# Altium project BI_820_Trek_GSM_GPS_hv3.PrjPCB
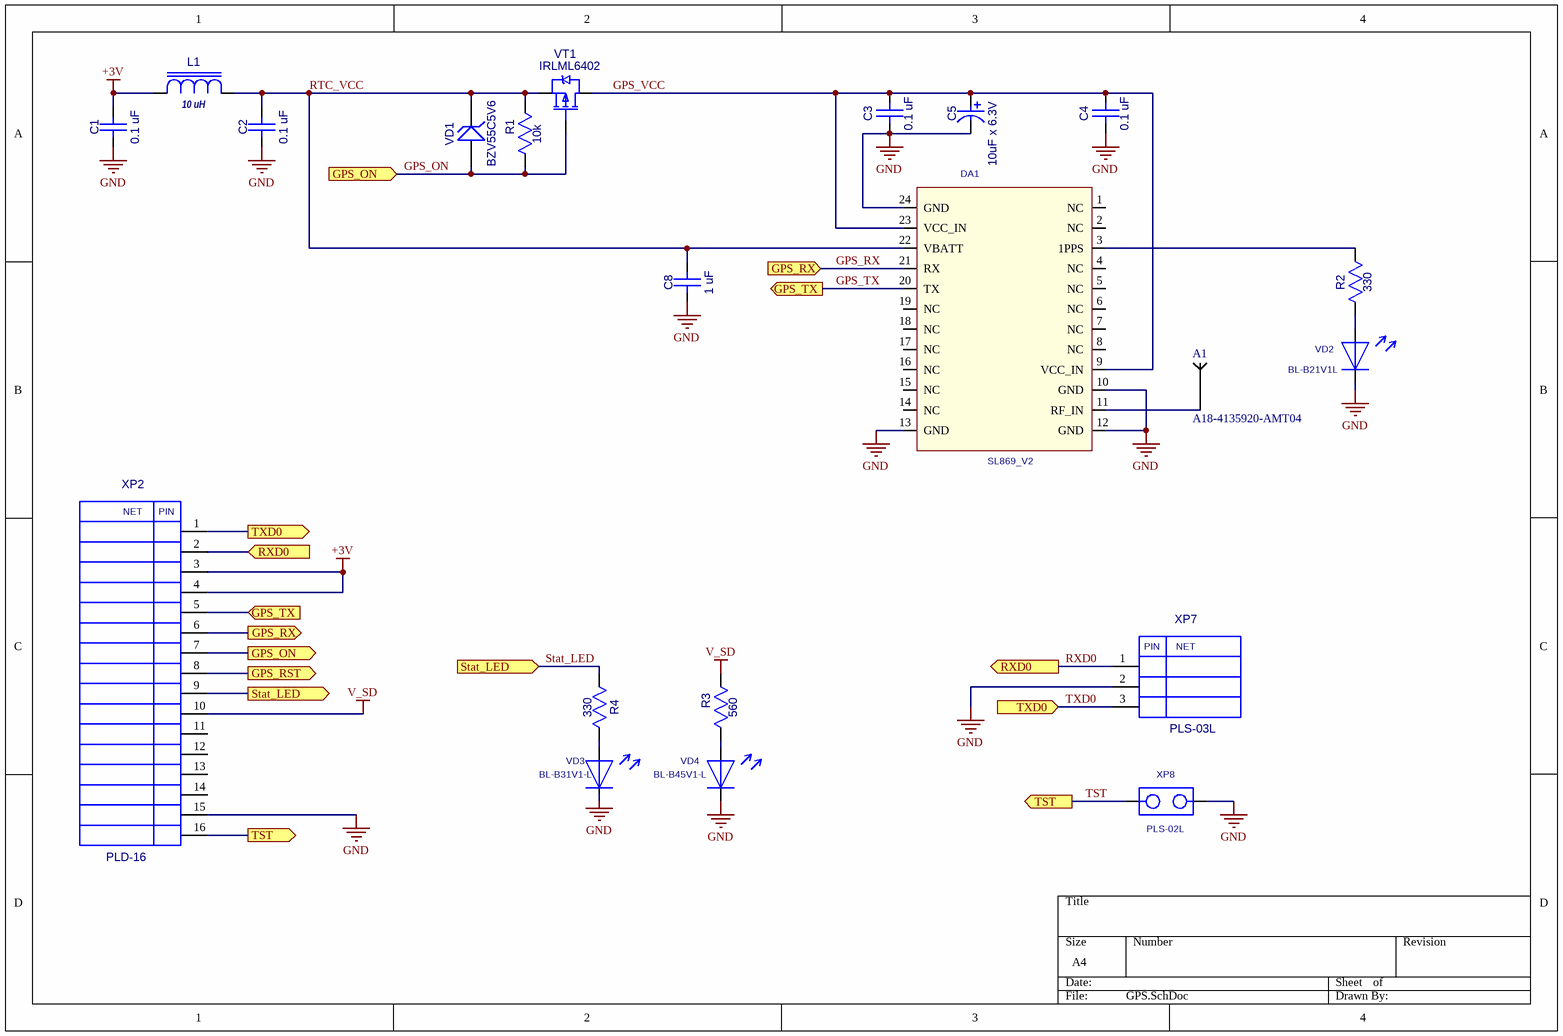
[diagram p0: GPS.SchDoc]
2 sheets, 43 parts. Net scope: flat (ports and power ports of the same name join across sheets).
Board file: BI_820_Trek_GSM_GPS_hv3.PcbDoc
Sheets:
  GPS.SchDoc
  GSM.SchDoc

## Sheet GPS.SchDoc
size A4

### Parts
A1  A18-4135920-AMT04  [BY-GPS-204]
C1  0.1 uF  [CC0603-3M]
C2  0.1 uF  [CC0603-3M]
C3  0.1 uF  [CC0603-3M]
C4  0.1 uF  [CC0603-3M]
C5  10uF x 6.3V  [TAJ-A_M]
C8  1 uF  [CC0603-3M]
DA1  SL869_V2  [SL868]
L1  10 uH  [RC0805-MIDI-2]
R1  10k  [RC0603-3M]
R2  330  [RC0603-3M]
R3  560  [RC0603-3M]
R4  330  [RC0603-3M]
VD1  BZV55C5V6  [SOD80]
VD2  BL-B21V1L  [LED3]
VD3  BL-B31V1-L  [LED3]
VD4  BL-B45V1-L  [LED3]
VT1  IRLML6402  [SOT-23(123)]
XP2  PLD-16  [PIN16]
XP7  PLS-03L  [PLS-03L]
XP8  PLS-02L  [PLS-02L]

### Ports
GPS_ON (in), GPS_ON (out), GPS_RST (out), GPS_RX (in), GPS_RX (out), GPS_TX (in), GPS_TX (out), RXD0 (in), RXD0 (out), Stat_LED (in), Stat_LED (out), TST (out), TXD0 (in), TXD0 (out)

### Nets
+3V: C1.2(B) L1.1(A) XP2.3 XP2.4
GND: C1.1(A) C2.1(A) C3.2(B) C4.2(B) C5.2(B) C8.1(A) DA1.10(GND) DA1.12(GND) DA1.13(GND) DA1.24(GND) VD2.1 VD3.1 VD4.1 XP2.15 XP7.2 XP8.2
V_SD: R3.2(B) XP2.10
GPS_ON: R1.2(B) VD1.1(A) VT1.1(G) XP2.7 ; port GPS_ON
GPS_RX: DA1.21(RX) XP2.6 ; port GPS_RX
GPS_TX: DA1.20(TX) XP2.5 ; port GPS_TX
GPS_VCC: C3.1(A) C4.1(A) C5.1(A) DA1.9(VCC_IN) DA1.23(VCC_IN) VT1.3(D)
RTC_VCC: C2.2(B) C8.2(B) DA1.22(VBATT) L1.2(B) R1.1(A) VD1.2 VT1.2(S)
RXD0: XP2.2 XP7.1 ; port RXD0
Stat_LED: R4.2(B) XP2.9 ; port Stat_LED
TST: XP2.16 XP8.1 ; port TST
TXD0: XP2.1 XP7.3 ; port TXD0
NetA1_1: A1.1 DA1.11(RF_IN)
NetDA1_3: DA1.3(1PPS) R2.1(A)
NetR2_2: R2.2(B) VD2.2
NetR3_1: R3.1(A) VD4.2
NetR4_1: R4.1(A) VD3.2
NetXP2_8: XP2.8 ; port GPS_RST

Not connected (* = marked no-connect by the designer): DA1 1(NC) 2(NC) 4(NC) 5(NC) 6(NC) 7(NC) 8(NC) 14(NC) 15(NC) 16(NC) 17(NC) 18(NC) 19(NC); XP2 11 12 13 14

### Notes on the sheet
- (in symbol PLD-16) NET; PIN
- (in symbol PLS-03L) PIN; NET

### Library data of the parts
A1 = BY-GPS-204: Passive GPS Antenna
C1-C4 C8 = CC0603
  C1-C4: Value: 0.1 uF
  C8: Value: 1 uF
C5 = TAJ-A: Value: 10uF x 6.3V
L1 = L0805: Value: 10 uH
R1-R4 = RC0603
  R1: Value: 10k
  R2 R4: Value: 330
  R3: Value: 560
VD1 = BZV55C5V1: Zener Voltage Regulator Diode; OriginalName: BZX84C10LT1; ComponentField6: Pin 2 is not connected and not drawn.; ComponentField7: Published 29-Sep-2000; Value: BZV55C5V6
VD2-VD4 = LED_3
  VD2: Value: BL-B21V1L
  VD3: Value: BL-B31V1-L
  VD4: Value: BL-B45V1-L
VT1 = IRLML6402: HEXFET Power MOSFET; OriginalName: IRLML5103; Value: {Value}; ComponentField7: Published 8-Jun-2000
DA1 = SL869_V2: Value: *
XP2 = PLD-16: Value: *
XP7 = PLS-03L: Value: *
XP8 = PLS-02L: Value: *

## Sheet GSM.SchDoc
size A4; PageSetup: Record=PageOptions|CenterHorizontal=True|CenterVertical=True|PrintScale=0.97|XCorrection=1.00|YCorrection=1.00|PrintKind=1|BorderSize=5000000|LeftOffset=0|BottomOffset=0|Orientation=2|PaperLength=1000|PaperWidth=1000|Scale=100|PaperSource=7|PrintQuality=-4|MediaType=1|DitherType=10|PaperKind=A4, 210x297 mm|PrintScaleMode=1
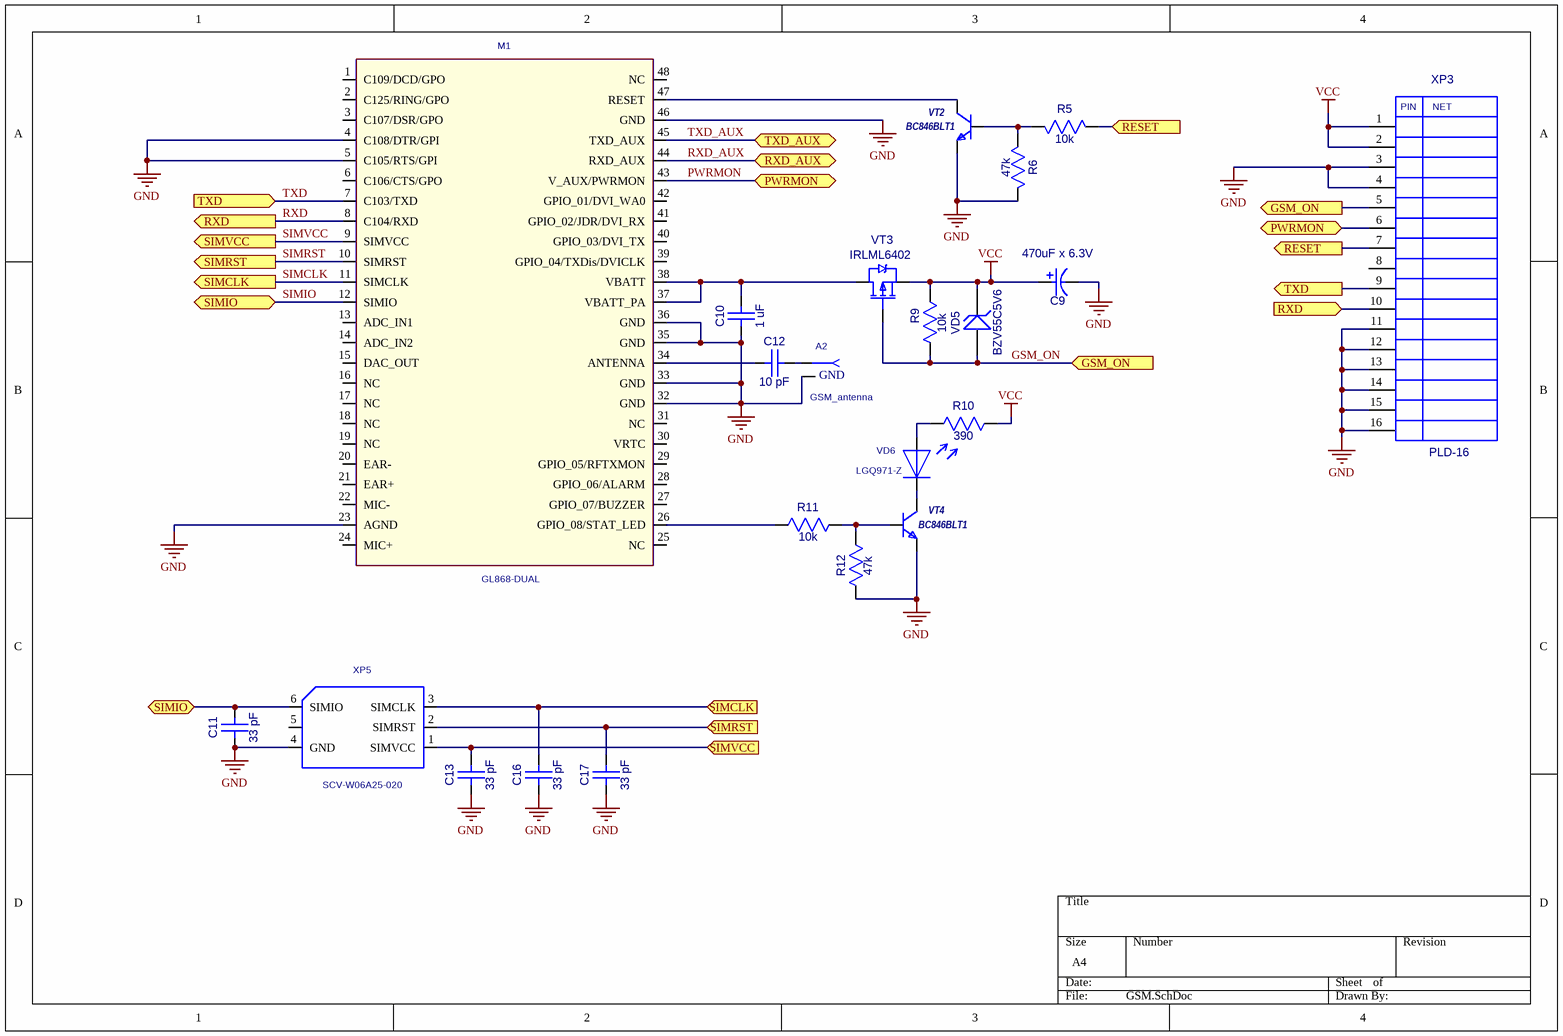
[diagram p1: GSM.SchDoc]

### Parts
A2  GSM_antenna  [GSM_antenna_pad]
C9  470uF x 6.3V  [TAJ-D-1M]
C10  1 uF  [CC0603-3M]
C11  33 pF  [CC0603-3M]
C12  10 pF  [CC0603-3M]
C13  33 pF  [CC0603-3M]
C16  33 pF  [CC0603-3M]
C17  33 pF  [CC0603-3M]
M1  GL868-DUAL  [GL868-DUAL]
R5  10k  [RC0603-3M]
R6  47k  [RC0603-3M]
R9  10k  [RC0603-3M]
R10  390  [RC0603-3M]
R11  10k  [RC0603-3M]
R12  47k  [RC0603-3M]
VD5  BZV55C5V6  [SOD80]
VD6  LGQ971-Z  [LED0603]
VT2  BC846BLT1  [SOT-23(123)]
VT3  IRLML6402  [SOT-23(123)]
VT4  BC846BLT1  [SOT-23(123)]
XP3  PLD-16  [PIN16]
XP5  SCV-W06A25-020  [SCVW06A25020]

### Ports
GSM_ON (in), GSM_ON (out), PWRMON, RESET (in), RESET (out), RXD (in), RXD (out), RXD_AUX, SIMCLK (in), SIMCLK (out), SIMIO, SIMIO (bidir), SIMRST (in), SIMRST (out), SIMVCC (in), SIMVCC (out), TXD (in), TXD (out), TXD_AUX

### Nets
GND: A2.2 C9.2(B) C10.1(A) C11.1(A) C13.1(A) C16.1(A) C17.1(A) M1.4(C108/DTR/GPI) M1.5(C105/RTS/GPI) M1.23(AGND) M1.32(GND) M1.33(GND) M1.35(GND) M1.36(GND) M1.46(GND) R6.2(B) R12.2(B) VT2.2(E) VT4.2(E) XP3.3 XP3.4 XP3.11 XP3.12 XP3.13 XP3.14 XP3.15 XP3.16 XP5.4(GND)
VCC: C9.1(A) R9.1(A) R10.2(B) VD5.2 VT3.2(S) XP3.1 XP3.2
GSM_ON: R9.2(B) VD5.1(A) VT3.1(G) XP3.5 ; port GSM_ON
PWRMON: M1.43(V_AUX/PWRMON) XP3.6 ; port PWRMON
RXD: M1.8(C104/RXD) XP3.10 ; port RXD
RXD_AUX: M1.44(RXD_AUX) ; port RXD_AUX
SIMCLK: C16.2(B) M1.11(SIMCLK) XP5.3(SIMCLK) ; port SIMCLK
SIMIO: C11.2(B) M1.12(SIMIO) XP5.6(SIMIO) ; port SIMIO
SIMRST: C17.2(B) M1.10(SIMRST) XP5.2(SIMRST) ; port SIMRST
SIMVCC: C13.2(B) M1.9(SIMVCC) XP5.1(SIMVCC) ; port SIMVCC
TXD: M1.7(C103/TXD) XP3.9 ; port TXD
TXD_AUX: M1.45(TXD_AUX) ; port TXD_AUX
NetA2_1: A2.1 C12.2(B)
NetC10_2: C10.2(B) M1.37(VBATT_PA) M1.38(VBATT) VT3.3(D)
NetC12_1: C12.1(A) M1.34(ANTENNA)
NetM1_26: M1.26(GPIO_08/STAT_LED) R11.1(A)
NetM1_47: M1.47(RESET) VT2.3(C)
NetR5_1: R5.1(A) XP3.7 ; port RESET
NetR5_2: R5.2(B) R6.1(A) VT2.1(B)
NetR10_1: R10.1(A) VD6.1
NetR11_2: R11.2(B) R12.1(A) VT4.1(B)
NetVD6_2: VD6.2 VT4.3(C)

Not connected (* = marked no-connect by the designer): M1 1(C109/DCD/GPO) 2(C125/RING/GPO) 3(C107/DSR/GPO) 6(C106/CTS/GPO) 13(ADC_IN1) 14(ADC_IN2) 15(DAC_OUT) 16(NC) 17(NC) 18(NC) 19(NC) 20(EAR-) 21(EAR+) 22(MIC-) 24(MIC+) 25(NC) 27(GPIO_07/BUZZER) 28(GPIO_06/ALARM) 29(GPIO_05/RFTXMON) 30(VRTC) 31(NC) 39(GPIO_04/TXDis/DVICLK) 40(GPIO_03/DVI_TX) 41(GPIO_02/JDR/DVI_RX) 42(GPIO_01/DVI_WA0) 48(NC); XP3 8; XP5 5

### Notes on the sheet
- (in symbol GSM_antenna_pad) GND
- (in symbol PLD-16) PIN; NET

### Library data of the parts
A2 = GSM_antenna_pad: Value: *
C9 = TAJ-D: Value: 470uF x 6.3V
C10-C13 C16 C17 = CC0603
  C10: Value: 1 uF
  C11 C13 C16 C17: Value: 33 pF
  C12: Value: 10 pF
R5 R6 R9-R12 = RC0603
  R5 R9 R11: Value: 10k
  R6 R12: Value: 47k
  R10: Value: 390
VD5 = BZV55C5V1: as VD1 on sheet GPS; Value: BZV55C5V6
VD6 = LED_0603: Value: LGQ971-Z
VT2 VT4 = BC846BLT1: ComponentField7: Published 29-Sep-2000; OriginalName: BC846BLT1
VT3 = IRLML6402: HEXFET Power MOSFET; OriginalName: IRLML5103; ComponentField7: Published 8-Jun-2000; Value: {Value}
M1 = GL868-DUAL: Value: *
XP3 = PLD-16: Value: *
XP5 = SCV-W06A25-020: Value: *

## Nets that join several sheets
GND: GPS (16 pins), GSM (28 pins)